# Altium schematic sheet Sheet1.SchDoc: transciever
size A3; Author: MK; Revision: 2.0; SheetNumber: 1; SheetTotal: 1
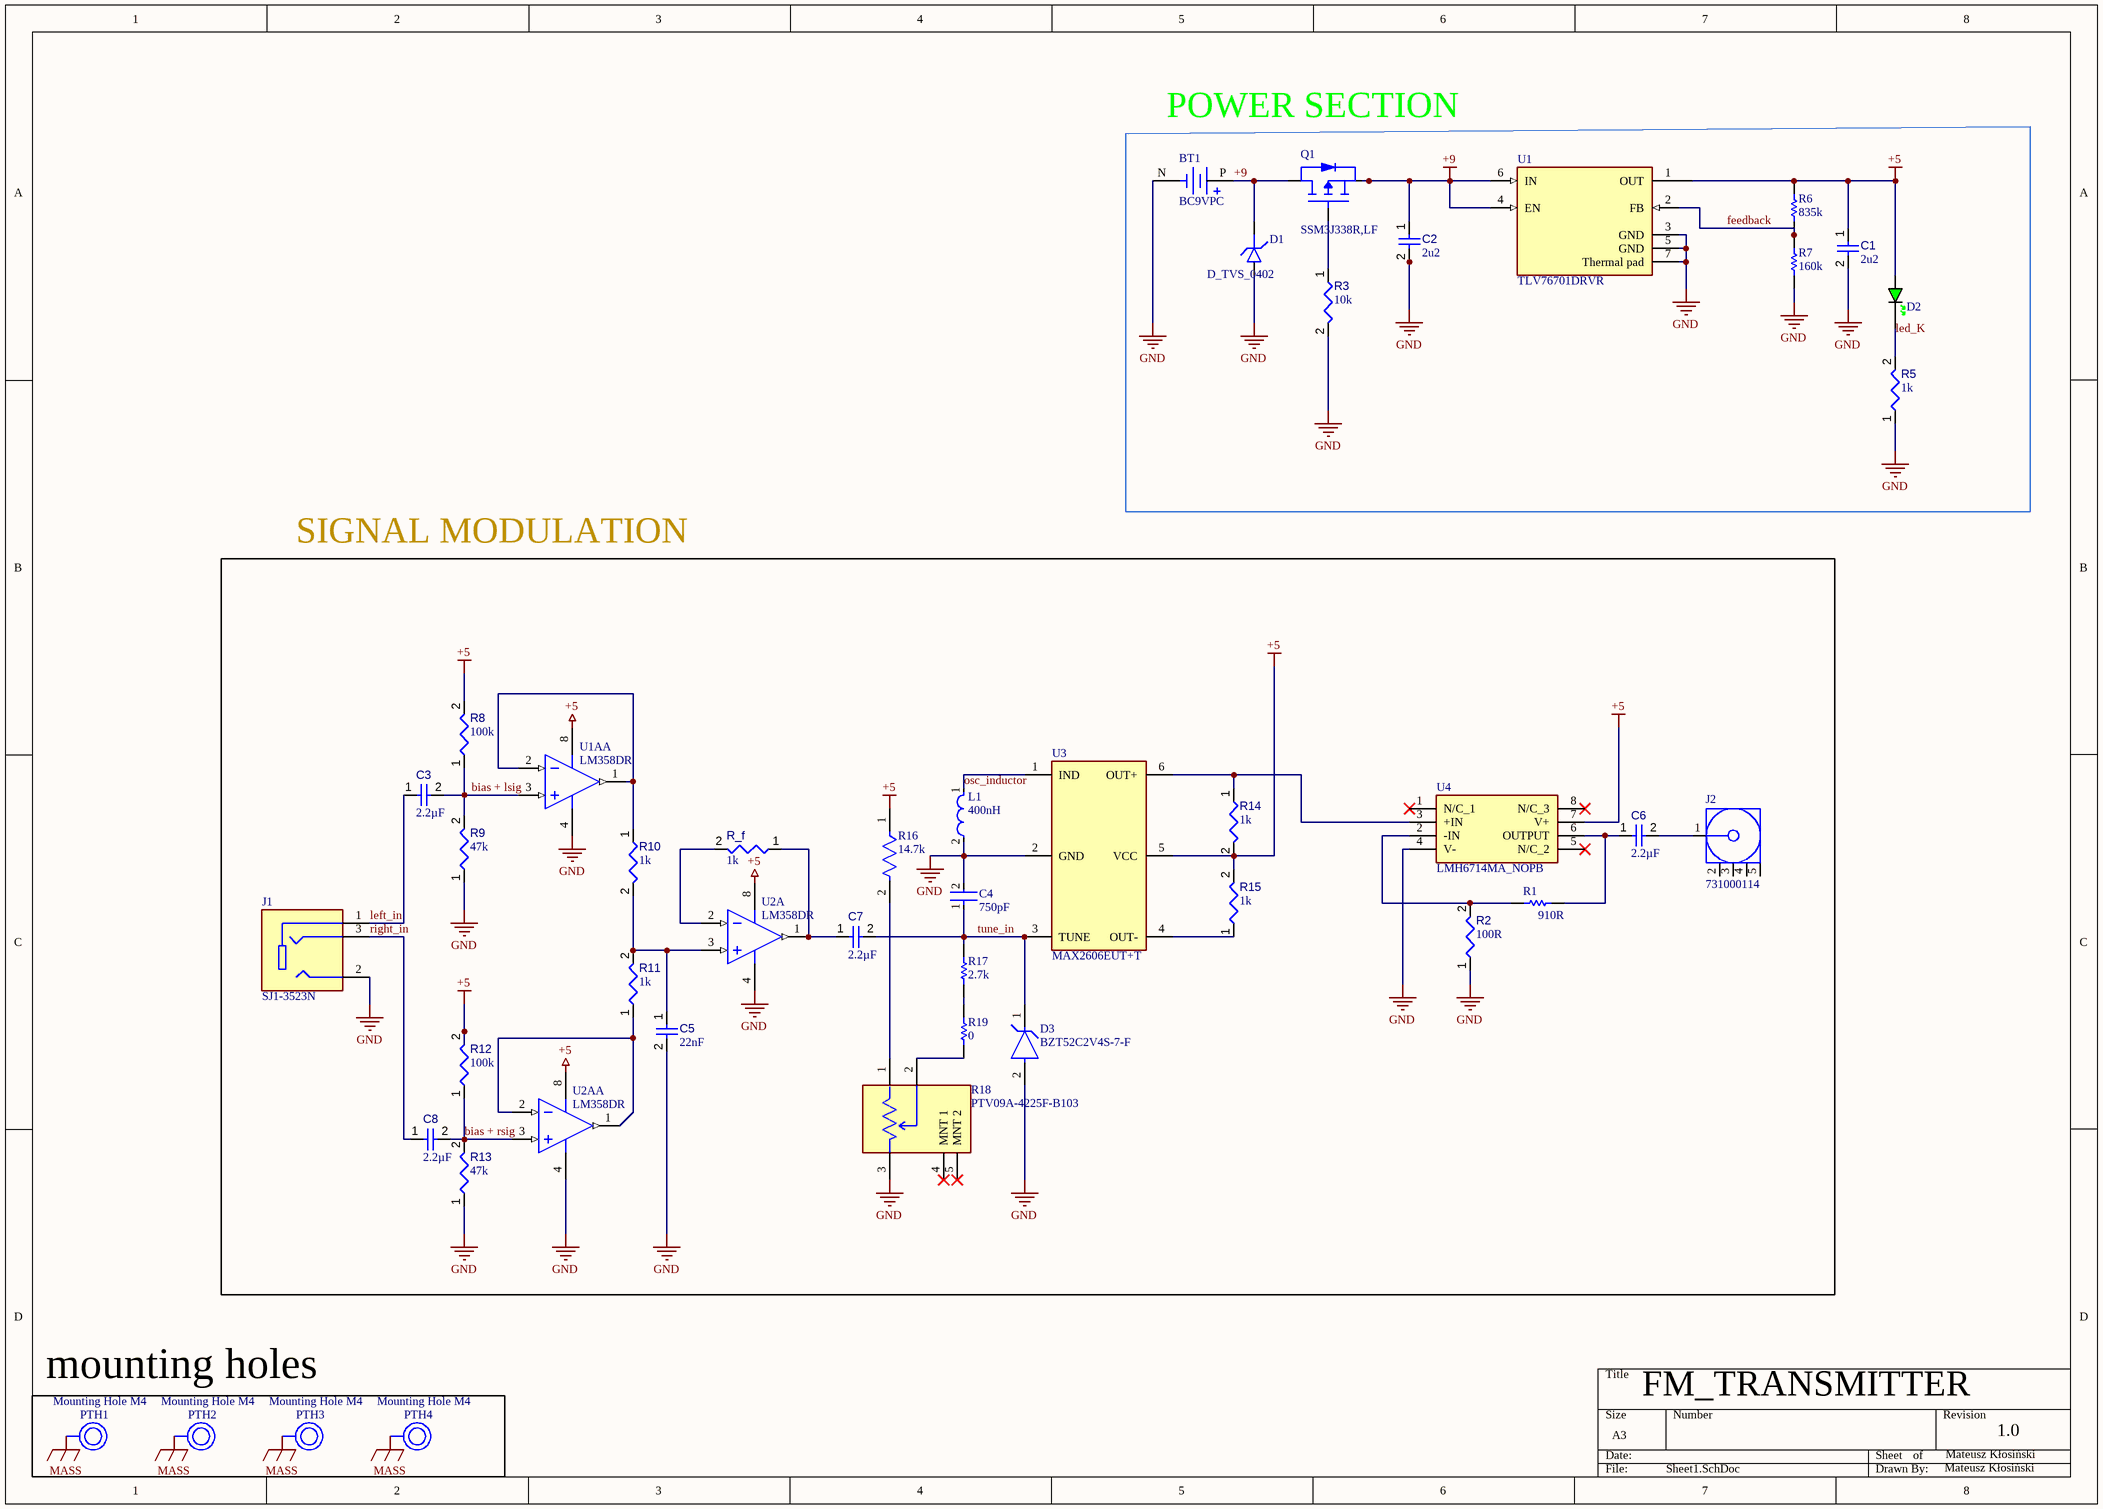
[diagram p0: Sheet1.SchDoc]

## Parts
BT1  BC9VPC  [BAT_BC9VPC]
C1  value 2u2  [CAPC0805(2012)145_L]  (hidden comment: Capacitor 100µF +/-20% 6.3V 0805)
C2  value 2u2  [CAPC0805(2012)145_L]  (hidden comment: Capacitor 100µF +/-20% 6.3V 0805)
C3  value 2.2µF  [CAPC0402(1005)60_L]  (hidden comment: Capacitor 2,2µF +/-20% 10V 0402)
C4  750pF  [FP-C0402-BB-MFG]
C5  value 22nF  [CAPC0402(1005)60_L]  (hidden comment: Capacitor 22nF +/-20% 10V 0402)
C6  value 2.2µF  [CAPC0402(1005)60_L]  (hidden comment: Capacitor 2,2µF +/-20% 10V 0402)
C7  value 2.2µF  [CAPC0402(1005)60_L]  (hidden comment: Capacitor 2,2µF +/-20% 10V 0402)
C8  value 2.2µF  [CAPC0402(1005)60_L]  (hidden comment: Capacitor 2,2µF +/-20% 10V 0402)
D1  D_TVS_0402  [D_0402]
D2  GREEN  [LED_0805_GREEN]  (value not drawn)
D3  BZT52C2V4S-7-F  [FP-SOD323-IPC_B]
J1  SJ1-3523N  [CUI_SJ1-3523N]
J2  731000114  [MOLX-731000114_V]
L1  400nH  [FP-LQW18CA_00-MFG]
PTH1  Mounting Hole M4  [Mounting Hole M4]
PTH2  Mounting Hole M4  [Mounting Hole M4]
PTH3  Mounting Hole M4  [Mounting Hole M4]
PTH4  Mounting Hole M4  [Mounting Hole M4]
Q1  SSM3J338R,LF  [SSM3J338R,LF-SOT23-F]
R1  910R  [RESC1608X55X30NL15T15]
R2  value 100R  [RESC0402(1005)_L]  (hidden comment: 100R2F)
R3  value 10k  [RESC0402(1005)_L]  (hidden comment: 10KR2F)
R5  value 1k  [RESC0805(2012)_L]  (hidden comment: 1KR5J)
R6  840K: 835k  [RESC2013X70X40ML20T20]  (hidden comment: Resistor 1k +/-1% 0805 125 mW)
R7  value 160k  [RESC2013X70X40ML20T20]  (hidden comment: Resistor 1k +/-1% 0805 125 mW)
R8  value 100k  [RESC1608X55X25ML10T15]  (hidden comment: Resistor 100k +/-1% 0603 100 mW)
R9  value 47k  [FP-ERA2A-IPC_B]  (hidden comment: ERA-2AEB473X)
R10  value 1k  [RESC0805(2012)_L]  (hidden comment: 1KR5J)
R11  value 1k  [RESC0805(2012)_L]  (hidden comment: 1KR5J)
R12  value 100k  [RESC1608X55X25ML10T15]  (hidden comment: Resistor 100k +/-1% 0603 100 mW)
R13  value 47k  [FP-ERA2A-IPC_B]  (hidden comment: ERA-2AEB473X)
R14  value 1k  [RESC0805(2012)_L]  (hidden comment: 1KR5J)
R15  value 1k  [RESC0805(2012)_L]  (hidden comment: 1KR5J)
R16  14.7k  [FP-ERA3A-MFG]
R17  2.7k  [RESC1608X55X30NL20T20]
R18  PTV09A-4225F-B103  [FP-PTV09A-4-MFG]
R19  value 0  [RESC1005X40X25ML05T10]  (hidden comment: Resistor 0R 0402 63 mW)
R_f  value 1k  [RESC0805(2012)_L]  (hidden comment: 1KR5J)
U1  TLV76701DRVR  [FP-DRV0006A-IPC_C]
U1A  LM358DR  [D0008A_L]  (part A of 2)
U2  LM358DR  [D0008A_L]  (part A of 2)
U2A  LM358DR  [D0008A_L]  (part A of 2)
U3  MAX2606EUT+T  [SOT95P280X145-6N]
U4  LMH6714MA_NOPB  [SOIC127P600X175-8N]

## Blocks framed on the sheet
SIGNAL MODULATION: C3-C8 D3 J1 J2 L1 R1 R2 R8-R19 R_f U1A U2 U2A U3 U4
mounting holes: PTH1-PTH4

## Nets
+5: C1.1 D2.A R6.2 R8.2 R12.2 R14.2 R15.2 R16.1 U1.1(OUT) U1A.8(VCC) U2.8(VCC) U2A.8(VCC) U3.5(VCC) U4.7(V+)
+9: BT1.P(POS) C2.1 D1.K Q1.D Q1.S U1.4(EN) U1.6(IN)
GND: BT1.N(NEG) C1.2 C2.2 C4.2 C5.2 D1.A D3.2(A) J1.2 L1.2 R2.1 R3.2 R5.1 R7.1 R9.1 R13.1 R18.3 U1.3(GND) U1.5(GND) U1.7(Thermal_pad) U1A.4(GND) U2.4(GND) U2A.4(GND) U3.2(GND) U4.4(V-)
MASS: PTH1.3 PTH2.3 PTH3.3 PTH4.3
bias + lsig: C3.2 R8.1 R9.2 U1A.3(1IN+)
bias + rsig: C8.2 R12.1 R13.2 U2A.3(1IN+)
feedback: R6.1 R7.2 U1.2(FB)
led_K: D2.K R5.2
left_in: C3.1 J1.1
osc_inductor: L1.1 U3.1(IND)
right_in: C8.1 J1.3
tune_in: C4.1 C7.2 D3.1(C) R17.2 U3.3(TUNE)
NetC5_1: C5.1 R10.2 R11.2 U2.3(1IN+)
NetC6_1: C6.1 R1.2 U4.6(OUTPUT)
NetC6_2: C6.2 J2.1
NetC7_1: C7.1 R_f.1 U2.1(1OUT)
NetQ1_G: Q1.G R3.1
NetR1_1: R1.1 R2.2 U4.2(-IN)
NetR10_1: R10.1 U1A.1(1OUT) U1A.2(1IN-)
NetR11_1: R11.1 U2A.1(1OUT) U2A.2(1IN-)
NetR14_1: R14.1 U3.6(OUT+) U4.3(+IN)
NetR15_1: R15.1 U3.4(OUT-)
NetR16_2: R16.2 R18.1
NetR17_1: R17.1 R19.2
NetR18_2: R18.2 R19.1
NetR_f_2: R_f.2 U2.2(1IN-)

Not connected (* = marked no-connect by the designer): J2 2 3 4 5; R18 4(MNT_1)* 5(MNT_2)*; U4 1(N/C_1)* 5(N/C_2)* 8(N/C_3)*

## Notes on the sheet
- POWER SECTION
- FM_TRANSMITTER
- Mateusz Kłosiński
- 1.0

## Library data of the parts
BT1 = CMP-00029-00001-1: Battery Holder 1 Cells 9V Size Plastic Tray; MF: MPD (Memory Protection Devices); Check_prices: https://www.snapeda.com/parts/BC9VPC/Memory+Protection+Devices/view-part/?ref=eda; Design Item ID: BC9VPC; Pins: 2; Case/Package: None; Value: *; SnapEDA_Link: https://www.snapeda.com/parts/BC9VPC/Memory+Protection+Devices/view-part/?ref=snap; Component Type: Standard; Source: BC9VPC.SchLib; MP: BC9VPC
C1 C2 = CMP-001-00054-4: Chip Capacitor, 100µF +/-20%, 6.3V, 0805, Thickness 1.45 mm; Tolerance: 10%; Min Operating Temperature: -55°C; Max Operating Temperature: 85°C; Pins: 2; Mounting Technology: SMT; Case/Package: 0805; Voltage Rating: 6.3V
C3 C6-C8 = CMP-001-00056-4: Chip Capacitor, 2,2µF +/-20%, 10V, 0402, Thickness 0.6 mm; Tolerance: 10%; Mounting Technology: SMT; Max Operating Temperature: 85°C; Case/Package: 0402; Pins: 2; Min Operating Temperature: -55°C; Voltage Rating: 10V
C4 = CMP-1034-01571-3: CAP CER 750PF 50V NP0 0402; Manufacturer: Kemet; Manufacturer Part Number: C0402C751J5GACTU; Temperature Characteristic: C0G; Temperature Coefficient: 15%; Tolerance: 0.05; Material: Ceramic; Value: 750 pF; Lead Free: Yes; ComponentLink2Description: Datasheet; Device Class L1: Passive Components; Octopart: https://octopart.com/c0402c751j5gactu-kemet-19049839; Capacitance: 750 pF; Temperature Range Low: -55°C; Voltage Rating: 50 V; RoHS: TRUE; Temperature: -55°C to +125°C; Automotive: No; Height: 0.55mm; Digikey Description: CAP CER 750PF 50V NP0 0402; ComponentLink2URL: https://content.kemet.com/datasheets/KEM_C1002_X7R_SMD.pdf; Device Class L2: Capacitors; Device Class L3: Ceramic Capacitors; Temperature Range High: +125°C; Category: Cap; Ipc Land Pattern Name: CAPC10050X50; Package: C0402-BB; Mouser Description: Multilayer Ceramic Capacitor, C Series, 750 Pf, - 5%, C0g / Np0, 50 V, 0402 [1005 Metric] Rohs Compliant: Yes
C5 = CMP-001-00062-3: Chip Capacitor, 22nF +/-20%, 10V, 0402, Thickness 0.6 mm; Tolerance: 10%; Min Operating Temperature: -55°C; Case/Package: 0402; Pins: 2; Max Operating Temperature: 85°C; Mounting Technology: SMT; Voltage Rating: 10V
D1 = D_TVS_0402: Diode TVS / ESD 0402
D2 = LED_0805_GREEN: LED 0805 GREEN SMD; Manufacturer: *; Manufacturer Part Number: *; Distributor Link: *; LCSC: *
D3 = CMP-12792-000028-1: DIODE ZENER 2.4V 200MW SOD323; Impedance: 100R; Zener Current: 5mA; Max Reverse Leakage Current: 50uA; ESD Protection: No; Output Current: 50mA; Tolerance: 8%; Element Configuration: Single; Number of Pins: 2; Max Operating Temperature: 150°C; Contact Plating: Tin; Min Operating Temperature: -65°C; REACH SVHC: No SVHC; Power Dissipation: 200mW; Test Current: 5mA; Peak Reverse Current: 50uA; Height: 1mm; Radiation Hardening: No; Termination: SMD/SMT; Power Rating: 200mW; Package Quantity: 3000; Zener Voltage: 2.4V; Max Power Dissipation: 200mW; Lead Free: Lead Free; Weight: 0.000173oz; Width: 1.4mm; Voltage Tolerance: 8%; Voltage Rating (DC): 2.4V; Packaging: Tape and Reel; Mount: Surface Mount; Length: 1.8mm
J1 = CMP-002-00094-1: 3.5 mm, Stereo, Right Angle, Through Hole, 3 Conductors, 0 Internal Switches, Audio Jack Connector; MF: CUI Devices; Pins: 3; Check_prices: https://www.snapeda.com/parts/SJ1-3523N/CUI+Devices/view-part/?ref=eda; Component Type: Standard; Value: *; Case/Package: None; MP: SJ1-3523N; CUI_purchase_URL: https://www.cuidevices.com/product/interconnect/connectors/audio-connectors/jacks/sj1-3523n?utm_source=snapeda.com&utm_medium=referral&utm_campaign=snapedaBOM; SnapEDA_Link: https://www.snapeda.com/parts/SJ1-3523N/CUI+Devices/view-part/?ref=snap; Source: SJ1-3523N.SchLib; Design Item ID: SJ1-3523N
J2 = CMP-2000-05487-1: SMA Right-Angle PCB Jack Receptacle, Brass Body, Gold Plated, 50 Ohm, 5-Pin THD, RoHS, Tray; Manufacturer: Molex; Datasheet Version: 09/2016; Package Description: 5-Pin Through Hole Device, Body 14.8 x 6.35 mm, Pitch 2.54 mm; Datasheet URL: http://www.molex.com/webdocs/datasheets/pdf/en-us/0731000114_RF_COAX_CONNECTORS.pdf; Manufacturer URL: http://www.molex.com/; Package Reference: 731000114; Mounting Technology: ThroughHole; Package URL: http://www.molex.com/pdm_docs/sd/731000114_sd.pdf
L1 = CMP-06042-011085-1: Wire Wound Ferrite type RF Inductor 400nH ±5% 680mA 0.26Ω 0603 (1608)
PTH1-PTH4 = CMP-00004-1: M4 size screw hole
Q1 = SSM3J338R,LF: MOSFET P-Channel Vds=12V Id=6A; Manufacturer Part Number: Toshiba; Manufacturer: SSM3J338R,LF
R1 = CMP-2000-00683-1: Manufacturer: Panasonic; Part Number: ERJ-3EKF9100V
R2 = CMP-009-00065-2: 100R 0.063W 1% 0402 (1005 Metric)  SMD; Power: 63mW; Tolerance: 1%; Case/Package: 0402; Pins: 2; Mounting Technology: SMT
R3 = CMP-009-00066-2: 10K 0.063W 1% 0402 (1005 Metric)  SMD; Power: 63mW; Case/Package: 0402; Mounting Technology: SMT; Pins: 2; Tolerance: 1%
R5 R10 R11 R14 R15 R_f = CMP-009-00076-2: 1K 0.125W 5% 0805 (2012 Metric)  SMD; Power: 125mW; Pins: 2; Mounting Technology: SMT; Tolerance: 5%; Case/Package: 0805
R6 R7 = CMP-009-00010-5: Chip Resistor, 1 KOhm, +/- 1%, 0.125 W, -55 to 155 degC, 0805 (2013 Metric); Power: 125mW; Voltage Rating: 150V; Tolerance: 1%; RoHS Compliant: True; Mounting Technology: SM; Pins: 2; Case/Package: 0805; Max Operating Temperature: 155°C; Min Operating Temperature: -55°C
R8 R12 = CMP-009-00023-5: Chip Resistor, 100 KOhm, +/- 1%, 0.1 W, -55 to 155 degC, 0603 (1608 Metric); Voltage Rating: 50V; Power: 100mW; Max Operating Temperature: 155°C; RoHS Compliant: True; Tolerance: 1%; Pins: 2; Case/Package: 0603; Mounting Technology: SM; Min Operating Temperature: -55°C
R9 R13 = CMP-009-00193-1: Fixed Resistor, Thin Film, 0.063W, 47000ohm, 50V, 0.1% +/-Tol, 25ppm/Cel, Surface Mount, 0402; Power: 63mW; Max Operating Temperature: 155°C; Tolerance: 0.1%; Min Operating Temperature: -55°C; RoHS Compliant: Yes; Case/Package: 0402; Mounting Technology: Surface Mount; Pins: 2
R16 = CMP-2000-00913-2: RES SMD 14.7KOHM 0.1% 1/10W 0603; Manufacturer: Panasonic Electronic Components; Manufacturer Part Number: ERA-3AEB1472V; Value: 14.7kΩ; Automotive Grade: Grade 0; Voltage Rating: 75V; Power Rating: 0.1W; Temperature Coefficient: 25ppm/°C; Lead Free: Yes; Footprint Url: https://industrial.panasonic.com/cdbs/www-data/pdf/RDM0000/DMM0000COL17.pdf; Temperature Range High: +155°C; Octopart: https://octopart.com/era3aeb1472v-panasonic-42876006; Device Class L2: Resistors; Tolerance: 0.1%; Automotive: Yes; Package: ERA3A; ComponentLink2Description: Datasheet; Mouser Description: Res Thin Film 1.6 x 0.8 mm 14.7K Ohm 0.1% 0.1W(1/10W) 25ppm/ C Molded SMD Punched Carrier T/R; Category: Res; Device Class L1: Passive Components; Resistance: 14.7kΩ; Temperature: -55°C to +155°C; ComponentLink2URL: https://industrial.panasonic.com/cdbs/www-data/pdf/RDM0000/AOA0000C307.pdf; RoHS: TRUE; Composition: Metal Film; Temperature Range Low: -55°C; Series: ERA; Device Class L3: Chip SMD Resistors; Height: 0.55mm; Digikey Description: RES SMD 14.7KOHM 0.1% 1/10W 0603
R17 = CMP-2000-00012-1: Manufacturer: Panasonic; Part Number: ERA3AEB272V
R18 = CMP-07234-000052-1: POT 10K OHM 1/20W CARBON LINEAR; Power Rating: 50mW; Number of Gangs: 1; Hole Diameter: 9.1mm; Actuator Diameter: 0.236inch; Resistance Tolerance: 20%; Resistance: 10kR; Actuator Length: 0.984inch; Min Operating Temperature: -10°C; RoHS Compliant: Yes; Technology: CARBON FILM; Radiation Hardening: No; Taper: Linear; Military Standard: Not; Type: Potentiometer; Mount: Through Hole; Length: 11.4mm; Tolerance: 20%; Max Power Dissipation: 50mW; Max Operating Temperature: 50°C; Package Quantity: 100; Termination: PCB; Packaging: Bulk; Depth: 12.5mm; Resistor Type: Carbon; Number of Turns: 1; Series: Pro Audio PTV09; Height: 12.5mm; REACH SVHC: No SVHC
R19 = CMP-009-00004-5: Chip Resistor, 0 Ohm, 0.063 W, -55 to 155 degC, 0402 (1005 Metric); Power: 63mW; Voltage Rating: 50V; Max Operating Temperature: 155°C; Pins: 2; RoHS Compliant: True; Min Operating Temperature: -55°C; Mounting Technology: SM; Case/Package: 0402
U1 = CMP-04917-000172-1: IC REG LINEAR POS ADJ 1A 6WSON
U1A U2 U2A = CMP-014-00024-2: Dual Operational Amplifier, 3 to 32 V, 0 to 70 degC, 8-Pin SOIC (D), Green (RoHS & no Sb/Br), Tape and Reel; Manufacturer: Texas Instruments (TI); Channels: 2; Min Supply Voltage: 1.5V; Max Supply Voltage: 16V; Package Version: 4040047-3/M, 06/2011; Common Mode Rejection Ratio: 65dB; Nominal Dual Supply Voltage: 12V; Output Current: 30mA; Slew Rate: 0.3V/us; Unity Gain Bandwidth Product: 700KHz; Nominal Supply Current: 1.2mA; Nominal Voltage Gain: 100dB; Packaging: CutTape; Manufacturer URL: http://www.ti.com/; RoHS Compliant: True; Datasheet Version: SLOS068T, 04/2015; Min Dual Supply Voltage: 1.5V; Max Operating Temperature: 70°C; Package Description: 8-Pin Small Outline Integrated Circuit, Body 4.9 x 3.9 mm, Pitch 1.27 mm; Package Reference: D0008A; Max Dual Supply Voltage: 16V; Nominal Supply Voltage: 12V; Mounting Technology: SM; Datasheet URL: http://www.ti.com/lit/ds/symlink/lm358.pdf; Case/Package: SOIC; Package URL: http://www.ti.com/lit/ml/msoi002j/msoi002j.pdf; Min Operating Temperature: 0°C; Pins: 8; Package Quantity: 1; Nominal Gain Bandwith Product: 700KHz
U3 = MAX2606EUT+T: VCO Oscillators 45MHz to 650MHz, Integrated IF VCOs with Differential Output; Manufacturer_Name: Analog Devices; Geometry.Height: 1.45mm; Mouser Part Number: 700-MAX2606EUTT; Mouser Price/Stock: https://www.mouser.co.uk/ProductDetail/Analog-Devices-Maxim-Integrated/MAX2606EUT%2bT?qs=GxOUx7aO6nxQrK5ySdDhWg%3D%3D; Manufacturer_Part_Number: MAX2606EUT+T; Datasheet Link: https://www.mouser.co.uk/datasheet/2/256/MAX2605-MAX2609-1515582.pdf
U4 = LMH6714MA_NOPB: Video op amp,LMH6714MA 250MHz  SO8; Manufacturer_Name: Texas Instruments; Manufacturer_Part_Number: LMH6714MA/NOPB; Geometry.Height: 1.75mm; Mouser Part Number: 926-LMH6714MA/NOPB; Mouser Price/Stock: https://www.mouser.co.uk/ProductDetail/Texas-Instruments/LMH6714MA-NOPB?qs=7lkVKPoqpbabNRERuC1FjQ%3D%3D; Datasheet Link: http://www.ti.com/lit/ds/symlink/lmh6714.pdf